# Altium schematic sheet coverSheet.SchDoc: FPGA Peripherals Board - Main
size A3; Author: mayerph; DrawnBy: mayerph; Organization: IIS; Revision: PA; SheetNumber: 1
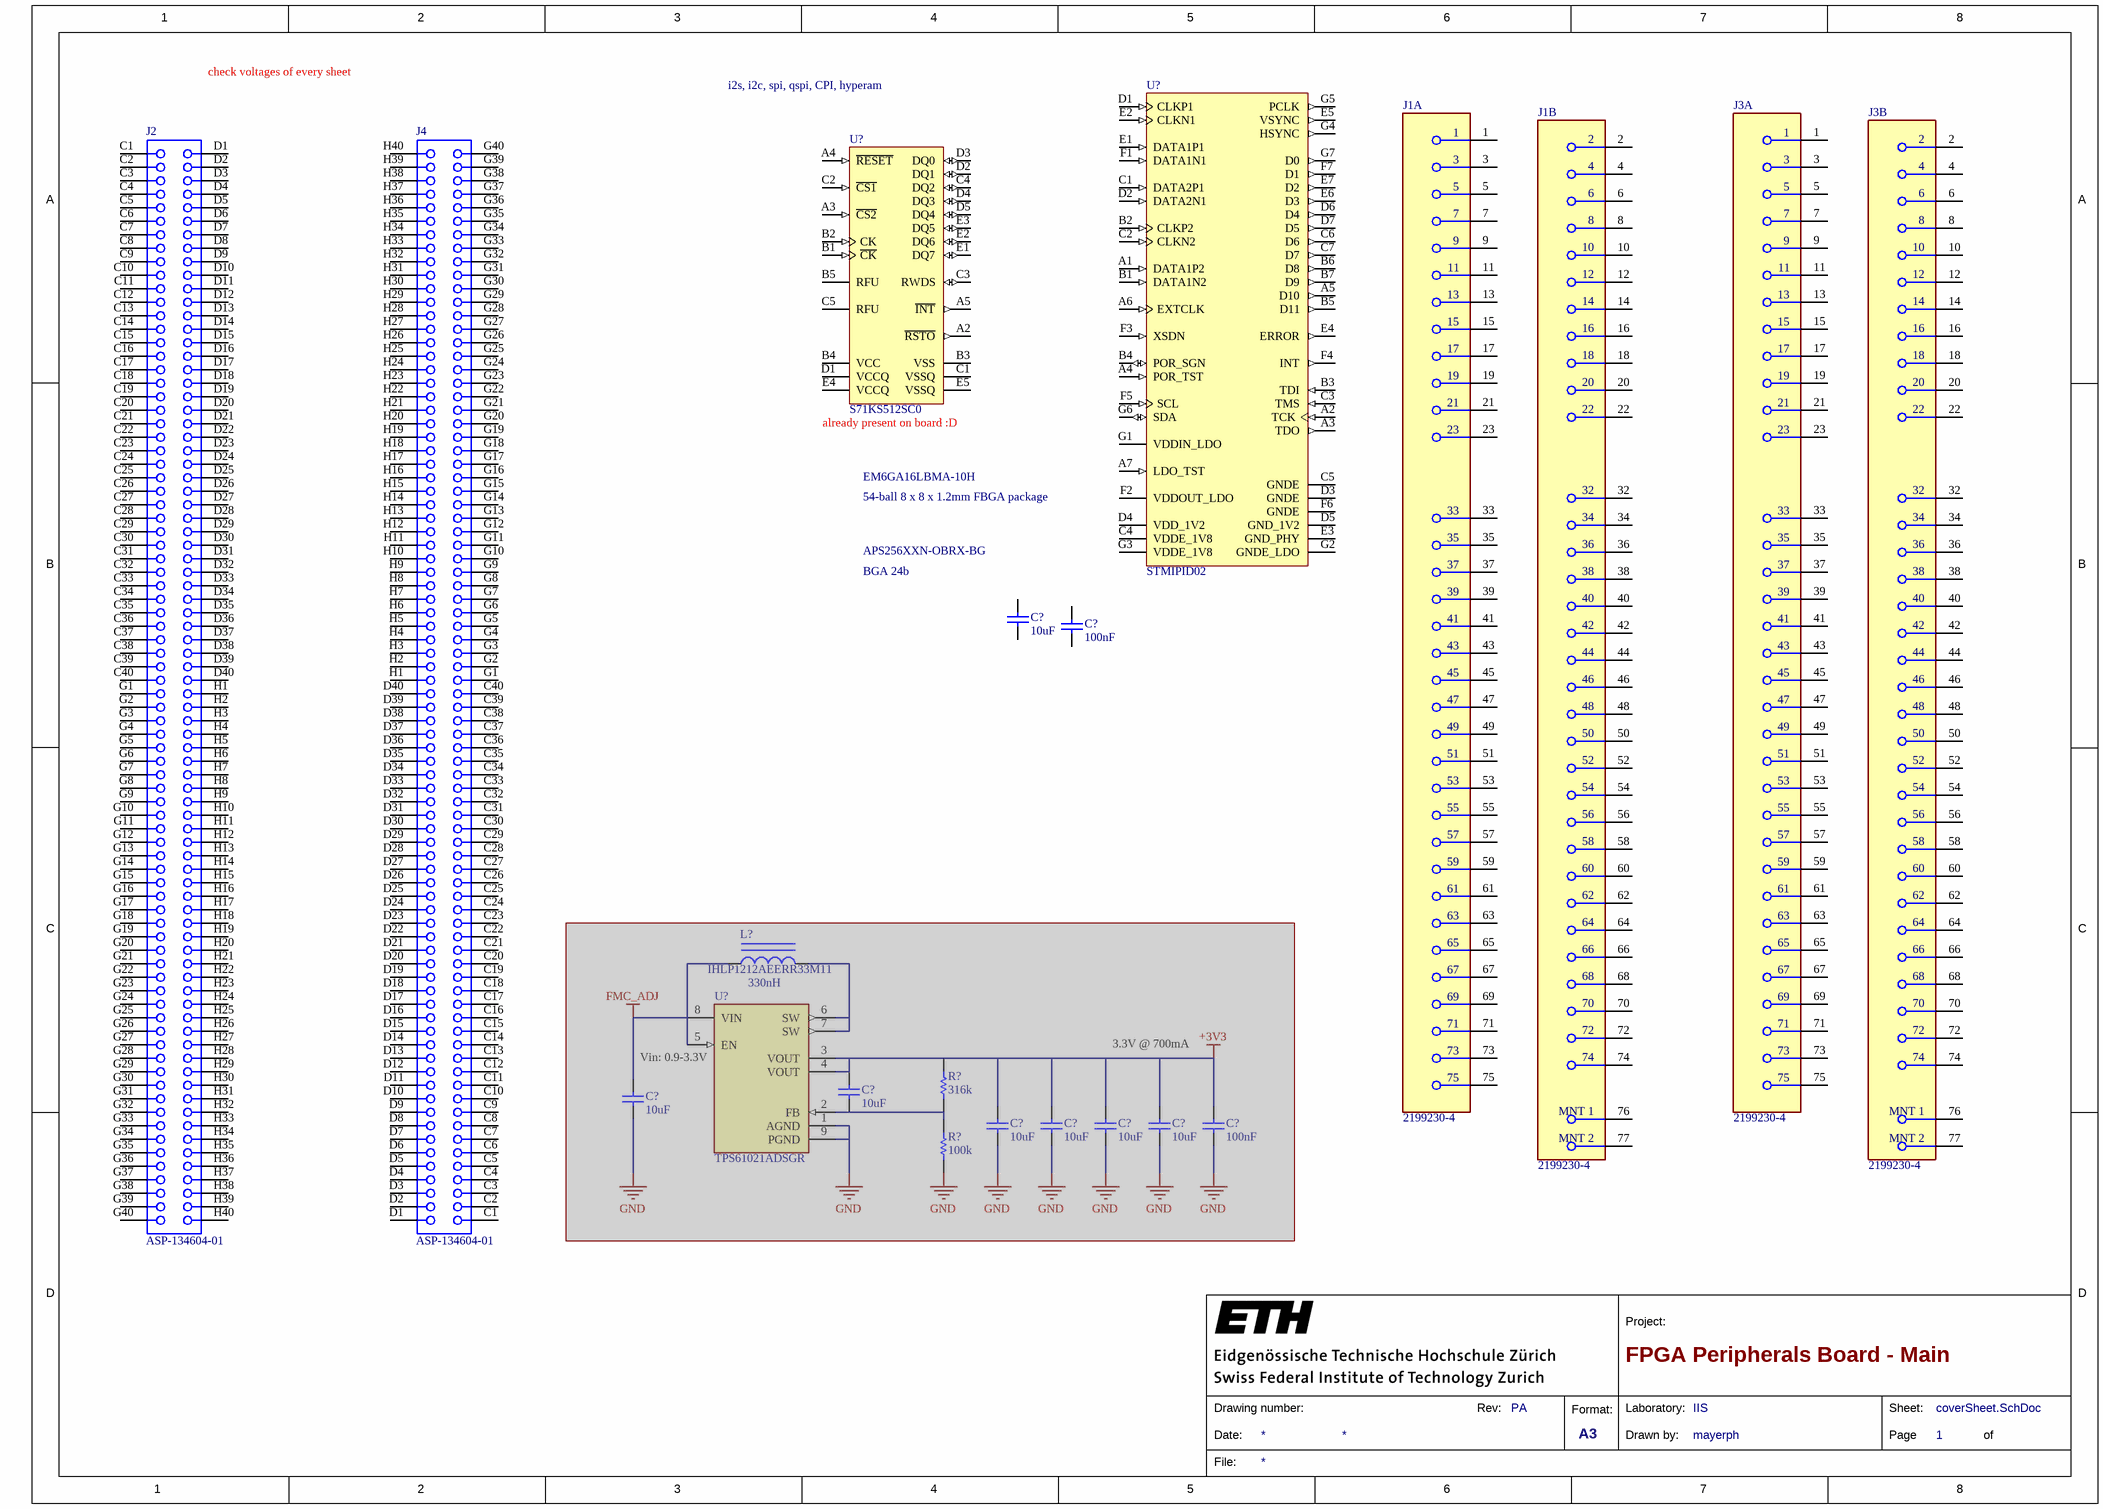
[diagram p0: coverSheet.SchDoc]

## Parts
(Parts that share a designator on the sheet are numbered #1, #2 ... from top to bottom, then left to right.)
C?#1  10uF  [CAPC0603(1608)100_L]
C?#2  100nF  [CAPC1050X55X23LL05T13]
C?#3  10uF  [CAPC0603(1608)100_L]  (masked out: inside a compile mask, not in the netlist)
C?#4  10uF  [CAPC0603(1608)100_L]  (masked out: inside a compile mask, not in the netlist)
C?#5  10uF  [CAPC0603(1608)100_L]  (masked out: inside a compile mask, not in the netlist)
C?#6  10uF  [CAPC0603(1608)100_L]  (masked out: inside a compile mask, not in the netlist)
C?#7  10uF  [CAPC0603(1608)100_L]  (masked out: inside a compile mask, not in the netlist)
C?#8  10uF  [CAPC0603(1608)100_L]  (masked out: inside a compile mask, not in the netlist)
C?#9  100nF  [CAPC1050X55X23LL05T13]  (masked out: inside a compile mask, not in the netlist)
J1  2199230-4  [FP-2199230-4-MFG]  (parts A,B of 2)
J2  ASP-134604-01  [ASP-134604-01]
J3  2199230-4  [FP-2199230-4-MFG]  (parts A,B of 2)
J4  ASP-134604-01  [ASP-134604-01]
L?  IHLP1212AEERR33M11  value 330nH  [IHLP1212]  (masked out: inside a compile mask, not in the netlist)
R?#1  316k  [RESC1005X40X25LL05T05]  (masked out: inside a compile mask, not in the netlist)
R?#2  100k  [RESC1005X40X25LL05T10]  (masked out: inside a compile mask, not in the netlist)
U?#1  STMIPID02  [BGA49C40P7X7_300X300X100]
U?#2  S71KS512SC0  [FBGA24_A-130]
U?#3  TPS61021ADSGR  [FP-DSG0008A-MFG]  (masked out: inside a compile mask, not in the netlist)

## Nets

Not connected (* = marked no-connect by the designer): C?#1 1 2; C?#2 1 2; J1 1 2 3 4 5 6 7 8 9 10 11 12 13 14 15 16 17 18 19 20 21 22 23 32 33 34 35 36 37 38 39 40 41 42 43 44 45 46 47 48 49 50 51 52 53 54 55 56 57 58 59 60 61 62 63 64 65 66 67 68 69 70 71 72 73 74 75 76(MNT_1) 77(MNT_2); J2 C1 C2 C3 C4 C5 C6 C7 C8 C9 C10 C11 C12 C13 C14 C15 C16 C17 C18 C19 C20 C21 C22 C23 C24 C25 C26 C27 C28 C29 C30 C31 C32 C33 C34 C35 C36 C37 C38 C39 C40 D1 D2 D3 D4 D5 D6 D7 D8 D9 D10 D11 D12 D13 D14 D15 D16 D17 D18 D19 D20 D21 D22 D23 D24 D25 D26 D27 D28 D29 D30 D31 D32 D33 D34 D35 D36 D37 D38 D39 D40 G1 G2 G3 G4 G5 G6 G7 G8 G9 G10 G11 G12 G13 G14 G15 G16 G17 G18 G19 G20 G21 G22 G23 G24 G25 G26 G27 G28 G29 G30 G31 G32 G33 G34 G35 G36 G37 G38 G39 G40 H1 H2 H3 H4 H5 H6 H7 H8 H9 H10 H11 H12 H13 H14 H15 H16 H17 H18 H19 H20 H21 H22 H23 H24 H25 H26 H27 H28 H29 H30 H31 H32 H33 H34 H35 H36 H37 H38 H39 H40; J3 1 2 3 4 5 6 7 8 9 10 11 12 13 14 15 16 17 18 19 20 21 22 23 32 33 34 35 36 37 38 39 40 41 42 43 44 45 46 47 48 49 50 51 52 53 54 55 56 57 58 59 60 61 62 63 64 65 66 67 68 69 70 71 72 73 74 75 76(MNT_1) 77(MNT_2); J4 C1 C2 C3 C4 C5 C6 C7 C8 C9 C10 C11 C12 C13 C14 C15 C16 C17 C18 C19 C20 C21 C22 C23 C24 C25 C26 C27 C28 C29 C30 C31 C32 C33 C34 C35 C36 C37 C38 C39 C40 D1 D2 D3 D4 D5 D6 D7 D8 D9 D10 D11 D12 D13 D14 D15 D16 D17 D18 D19 D20 D21 D22 D23 D24 D25 D26 D27 D28 D29 D30 D31 D32 D33 D34 D35 D36 D37 D38 D39 D40 G1 G2 G3 G4 G5 G6 G7 G8 G9 G10 G11 G12 G13 G14 G15 G16 G17 G18 G19 G20 G21 G22 G23 G24 G25 G26 G27 G28 G29 G30 G31 G32 G33 G34 G35 G36 G37 G38 G39 G40 H1 H2 H3 H4 H5 H6 H7 H8 H9 H10 H11 H12 H13 H14 H15 H16 H17 H18 H19 H20 H21 H22 H23 H24 H25 H26 H27 H28 H29 H30 H31 H32 H33 H34 H35 H36 H37 H38 H39 H40; U?#1 A1(DATA1P2) A2(TCK) A3(TDO) A4(POR_TST) A5(D10) A6(EXTCLK) A7(LDO_TST) B1(DATA1N2) B2(CLKP2) B3(TDI) B4(POR_SGN) B5(D11) B6(D8) B7(D9) C1(DATA2P1) C2(CLKN2) C3(TMS) C4(VDDE_1V8) C5(GNDE) C6(D6) C7(D7) D1(CLKP1) D2(DATA2N1) D3(GNDE) D4(VDD_1V2) D5(GND_1V2) D6(D4) D7(D5) E1(DATA1P1) E2(CLKN1) E3(GND_PHY) E4(ERROR) E5(VSYNC) E6(D3) E7(D2) F1(DATA1N1) F2(VDDOUT_LDO) F3(XSDN) F4(INT) F5(SCL) F6(GNDE) F7(D1) G1(VDDIN_LDO) G2(GNDE_LDO) G3(VDDE_1V8) G4(HSYNC) G5(PCLK) G6(SDA) G7(D0); U?#2 A2(~{RSTO}) A3(~{CS2}) A4(~{RESET}) A5(~{INT}) B1(~{CK}) B2(CK) B3(VSS) B4(VCC) B5(RFU) C1(VSSQ) C2(~{CS1}) C3(RWDS) C4(DQ2) C5(RFU) D1(VCCQ) D2(DQ1) D3(DQ0) D4(DQ3) D5(DQ4) E1(DQ7) E2(DQ6) E3(DQ5) E4(VCCQ) E5(VSSQ)

## Notes on the sheet
- check voltages of every sheet
- i2s, i2c, spi, qspi, CPI, hyperam
- (near U?#2) already present on board :D
- EM6GA16LBMA-10H
- 54-ball 8 x 8 x 1.2mm FBGA package
- APS256XXN-OBRX-BG
- BGA 24b
- 3.3V @ 700mA
- (near U?#3) Vin: 0.9-3.3V
- 1
- 2
- 3
- 4
- 5
- 6
- 7
- 8
- A
- B
- C
- D
- Project:
- Date:
- Drawing number:
- Rev:
- Format:
- A3
- Drawn by:
- Laboratory:
- Page
- Sheet:
- of
- File:

## Library data of the parts
C?#1 C?#3-C?#8 = CMP-1035-02799-1: CAP 10uF 10V ±10% 0603 (1608 Metric) Thickness 1mm SMD; Manufacturer: Samsung; Manufacturer Part Number: CL10A106MP8NNNC; Tolerance: Â±10%; Case-Metric: 1608; Case-EIA: 0603; Dielectric: X5R; Max Thickness: 1 mm; Technology: SMT; Rated Voltage: 10 V; Value: 10uF; Supplier 1: Digi-Key; Supplier Part Number 1: 1276-1871-1-ND; RoHS: Yes; Category: Ceramic Capacitors; Stock 1: 643992; Pricing 1: 1=0.26000, 10=0.17600, 50=0.10580, 100=0.08930, 500=0.06112, 1000=0.05407 (USD); Mount: Surface Mount; Case/Package: 0603; Case Code (Imperial): 0603; Case Code (Metric): 1608; Contact Plating: Tin; Min Operating Temperature: -55°C; Max Operating Temperature: 85°C; Packaging: Tape and Reel; Capacitance: 10uF; Voltage Rating: 10V; Voltage Rating (DC): 10V; Package Quantity: 1; Length: 1.6mm; Width: 0.031inch; Height: 0.8mm; Thickness: 0.035inch; Depth: 0.8mm; Radiation Hardening: No; Lead Free: Lead Free; ComponentLink1URL: https://datasheet.ciiva.com/25793/cl10a106mp8nnnc-25793222.pdf?src-supplier=Digi-Key; ComponentLink1Description: https://datasheet.ciiva.com/25793/cl10a106mp8nnnc-25793222.pdf?src-supplier=Digi-Key; ComponentLink2URL: https://datasheet.ciiva.com/16200/cl10a106mp8nnnc-16200411.pdf?src-supplier=Future+Electronics; ComponentLink2Description: https://datasheet.ciiva.com/16200/cl10a106mp8nnnc-16200411.pdf?src-supplier=Future+Electronics; ComponentLink3URL: https://datasheet.ciiva.com/26946/getdatasheetpartid-357531-26946980.pdf?src-supplier=Verical; ComponentLink3Description: https://datasheet.ciiva.com/26946/getdatasheetpartid-357531-26946980.pdf?src-supplier=Verical
C?#2 C?#9 = CMP-2000-05439-1: Chip Capacitor, 100 nF, +/- 10%, 16 V, -55 to 125 degC, 0402 (1005 Metric), RoHS, Tape and Reel; Manufacturer: Samsung Electro-Mechanics; Manufacturer Part Number: CL05B104KO5NNNC; Dielectric: X7R; Rated Voltage: 16V; Material: Ceramic; Case Size/Dimension: 0402; Tolerance (%): ±10%; Value: 100nF; Manufacturer URL: http://www.samsungsem.com/global/index.jsp; Datasheet URL: https://datasheet.ciiva.com/29198/458718-da-01-en-vs-kondensator-0402-29198423.pdf; Datasheet Version: Nov-10; Supplier 1: Digi-Key; Supplier Part Number 1: 1276-1001-1-ND; RoHS: Yes; Category: Ceramic Capacitors; Stock 1: 18886859; Pricing 1: 1=0.10000, 10=0.02800, 50=0.01520, 100=0.01240, 500=0.00886, 1000=0.00696, 2500=0.00632, 5000=0.00582 (USD); Mount: Surface Mount; Case/Package: 0402; Case Code (Metric): 1005; Case Code (Imperial): 0402; Contact Plating: Tin; Min Operating Temperature: -55°C; Max Operating Temperature: 125°C; Tolerance: 10%; Packaging: Tape and Reel; Voltage Rating: 16V; Voltage Rating (DC): 16V; Package Quantity: 1; Voltage: 16V; Length: 1mm; Height: 0.5mm; Width: 0.02inch; Depth: 0.5mm; Thickness: 0.022inch; Radiation Hardening: No; Lead Free: Lead Free; ComponentLink1URL: https://datasheet.ciiva.com/26920/getdatasheetpartid-359683-26920169.pdf?src-supplier=Verical; ComponentLink1Description: https://datasheet.ciiva.com/26920/getdatasheetpartid-359683-26920169.pdf?src-supplier=Verical; ComponentLink2URL: https://datasheet.ciiva.com/29198/458718-da-01-en-vs-kondensator-0402-29198423.pdf?src-supplier=Conrad; ComponentLink2Description: https://datasheet.ciiva.com/29198/458718-da-01-en-vs-kondensator-0402-29198423.pdf?src-supplier=Conrad; ComponentLink3URL: https://datasheet.ciiva.com/16208/cl05b104kq5nnnc-16208343.pdf?src-supplier=Future+Electronics; ComponentLink3Description: https://datasheet.ciiva.com/16208/cl05b104kq5nnnc-16208343.pdf?src-supplier=Future+Electronics; ComponentLink4URL: https://datasheet.ciiva.com/26309/mlcc-catalogdownload2013-eng-26309003.pdf?src-supplier=Distrelec; ComponentLink4Description: https://datasheet.ciiva.com/26309/mlcc-catalogdownload2013-eng-26309003.pdf?src-supplier=Distrelec
J1 J3 = CMP-03365-000002-1: CONN FEMALE 67POS 0.020 GOLD; Manufacturer: TE Connectivity; Conn Orientation: Right Angle; Pitch: 0.5mm; Number Of Contacts: 67; Voltage Rating: 50V; Is Female: yes; Current Rating: 0.5A; Contact Current Rating: 500mA; Insulation Resistance: 500MR; Row Spacing: 7.55mm; Lead Free: Yes; Temperature Range Low: -40°C; Device Class L3: unset; Package: 0; Manufacturer Part Number: 2199230-4; RoHS: TRUE; Digikey Description: CONN FEMALE 67POS 0.020 GOLD; Category: Conn; Device Class L1: Connectors; Temperature Range High: +80°C; ComponentLink2Description: Datasheet; ComponentLink2URL: https://www.te.com/commerce/DocumentDelivery/DDEController?Action=showdoc&DocId=Customer+Drawing%7F2199230%7FB3%7Fpdf%7FEnglish%7FENG_CD_2199230_B3.pdf%7F2199230-4; Mouser Description: PCI Express / PCI Connectors .5PITCH 4.2H KEY E EMBOSS NGFF MINICARD; Automotive: No; Conn Gender: Female; Height: 4.2mm; Device Class L2: Card Edge Connectors; Contact Material: Gold,Nickel; Number Of Rows: 2; Octopart: https://octopart.com/2199230-4-te+connectivity-46436156; Temperature: -40°C to +80°C; Supplier 1: Digi-Key; Supplier Part Number 1: A115904CT-ND; Stock 1: 15639; Pricing 1: 1=1.29000, 10=1.13700, 25=1.07000, 50=1.02560, 100=0.98100, 250=0.89180, 500=0.80262 (USD); Mount: Surface Mount; Contact Plating: Gold,Matte; Housing Color: Black; Housing Material: Thermoplastic; Color: Black; Insulation Material: Thermoplastic; Min Operating Temperature: -40°C; Max Operating Temperature: 80°C; Packaging: Tape and Reel; Number of Positions: 67; PCB Mounting Orientation: Right Angle; Package Quantity: 1; Gender: Female; Termination: Solder; Orientation: Right Angle; Length: 0.862inch; Width: 8.7mm; REACH SVHC: Unknown; ELV: Compliant; ComponentLink1URL: https://datasheet.ciiva.com/28797/1918022-28797830.pdf?src-supplier=Element14; ComponentLink1Description: https://datasheet.ciiva.com/28797/1918022-28797830.pdf?src-supplier=Element14; ComponentLink3URL: https://datasheet.ciiva.com/18495/eng-cd-2199230-b1-c-2199230-b1-18495978.pdf?src-supplier=Digi-Key; ComponentLink3Description: https://datasheet.ciiva.com/18495/eng-cd-2199230-b1-c-2199230-b1-18495978.pdf?src-supplier=Digi-Key; ComponentLink4URL: https://datasheet.ciiva.com/18495/eng-cd-2199230-b1-c-2199230-b1-18495979.pdf?src-supplier=Digi-Key; ComponentLink4Description: https://datasheet.ciiva.com/18495/eng-cd-2199230-b1-c-2199230-b1-18495979.pdf?src-supplier=Digi-Key; ComponentLink5URL: https://datasheet.ciiva.com/18495/eng-cd-2199230-b1-c-2199230-b1-18495980.pdf?src-supplier=Digi-Key; ComponentLink5Description: https://datasheet.ciiva.com/18495/eng-cd-2199230-b1-c-2199230-b1-18495980.pdf?src-supplier=Digi-Key; ComponentLink6URL: https://datasheet.ciiva.com/22714/1918022-22714780.pdf?src-supplier=Element14; ComponentLink6Description: https://datasheet.ciiva.com/22714/1918022-22714780.pdf?src-supplier=Element14; ComponentLink7URL: https://datasheet.ciiva.com/28797/1918022-28797822.pdf?src-supplier=Element14; ComponentLink7Description: https://datasheet.ciiva.com/28797/1918022-28797822.pdf?src-supplier=Element14
J2 = CMP-00488-1: Conn Array Terminal FMC Male SKT 160 POS 1.27mm Solder ST SMD; Manufacturer: Samtec; Number of arrays: 4; Number of poles: 160; Pitch: 1.27mm; Product type: SKT; Width: 14.68mm; Wire connection method: Solder; Length: 55.78mm; Manufacturer Part Number: ASP-134604-01; Supplier: Digikey; Supplier Part Number: SAM8732-ND; ComponentLink1Description: asp-134604-01-9532665.pdf; ComponentLink1URL: https://datasheet.ciiva.com/9532/asp-134604-01-9532665.pdf; ComponentLink2Description: asp-134604-01-403751.pdf; ComponentLink2URL: https://datasheet.ciiva.com/403/asp-134604-01-403751.pdf
J4 = CMP-00488-2: Conn Array Terminal FMC Male SKT 160 POS 1.27mm Solder ST SMD; Manufacturer: Samtec; Number of arrays: 4; Number of poles: 160; Pitch: 1.27mm; Product type: SKT; Width: 14.68mm; Wire connection method: Solder; Length: 55.78mm; Manufacturer Part Number: ASP-134604-01; Supplier: Digikey; Supplier Part Number: SAM8732-ND; ComponentLink1Description: asp-134604-01-9532665.pdf; ComponentLink1URL: https://datasheet.ciiva.com/9532/asp-134604-01-9532665.pdf; ComponentLink2Description: asp-134604-01-403751.pdf; ComponentLink2URL: https://datasheet.ciiva.com/403/asp-134604-01-403751.pdf
L? = CMP-01325-1: FIXED IND 330NH 7.8A 13.8 MOHM; Max DC Current: 7A; DC Resistance (DCR): 13.8mR; Tolerance: 20%; Test Frequency: 100kHz; Core Material: Ferrite; Shielding: Shielded; Self Resonant Frequency: 1MHz; Number of Pins: 2; Rated Current-Max: 7.8A; Packaging: Tape and Reel; Radiation Hardening: No; Depth: 3.2mm; Termination: SMD/SMT; REACH SVHC: Unknown; Width: 3mm; Height - Seated (Max): 0.059inch; Current Rating: 7.8A; Min Operating Temperature: -55°C; Case/Package: 1212; Package Quantity: 3000; Inductance: 330nH; Series: IHLP-1212AE-11; Lead Free: Lead Free; Height: 1.2mm; RMS Current (Irms): 7.8A; Saturation Current: 7A; Inductance Tolerance: 20%; Military Standard: Not; Max Operating Temperature: 125°C; Length: 3.6mm; Mount: Surface Mount; RoHS Compliant: Yes
R?#1 = CMP-2002-00863-1: Manufacturer: Panasonic; Part Number: ERJ-2RKF3163X; Value: 316 kOhm; Power Rating: 100mW; Tolerance: 1%; Temperature Coefficient: 100ppm/°C; Voltage Rating: 50V; Supplier 1: Digi-Key; Supplier Part Number 1: P316KLCT-ND; Manufacturer Part Number: ERJ-2RKF3163X; RoHS: Yes; Category: Chip SMD Resistors; Stock 1: 50; Pricing 1: 1=0.10000, 10=0.02200, 100=0.00880, 1000=0.00398, 2500=0.00345, 5000=0.00285 (USD); Mount: Surface Mount; Case/Package: 0402; Case Code (Metric): 1005; Case Code (Imperial): 0402; Contact Plating: Tin; Min Operating Temperature: -55°C; Max Operating Temperature: 155°C; Packaging: Tape and Reel; Resistor Type: Thick Film; Package Quantity: 1; Termination: SMD/SMT; Series: ERJ; Voltage Rating (DC): 50V; Number of Terminations: 2; Max Power Dissipation: 100mW; Features: Automotive AEC-Q200; Construction: Rectangular; Resistance Tolerance: 1%; Length: 1mm; Width: 0.02inch; Height: 0.016inch; Depth: 0.5mm; RoHS Compliant: Yes; Lead Free: Lead Free; REACH SVHC: No SVHC; Military Standard: Not; ComponentLink1URL: https://datasheet.ciiva.com/24070/aoa0000ce2-24070773.pdf?src-supplier=Mouser; ComponentLink1Description: https://datasheet.ciiva.com/24070/aoa0000ce2-24070773.pdf?src-supplier=Mouser; ComponentLink2URL: https://datasheet.ciiva.com/43467/1678782-43467525.pdf?src-supplier=Farnell; ComponentLink2Description: https://datasheet.ciiva.com/43467/1678782-43467525.pdf?src-supplier=Farnell; ComponentLink3URL: https://datasheet.ciiva.com/30180/aoa0000ce2-30180486.pdf?src-supplier=Onlinecomponents.com; ComponentLink3Description: https://datasheet.ciiva.com/30180/aoa0000ce2-30180486.pdf?src-supplier=Onlinecomponents.com; ComponentLink4URL: https://datasheet.ciiva.com/9183/aoa0000ce2-9183095.pdf?src-supplier=Avnet; ComponentLink4Description: https://datasheet.ciiva.com/9183/aoa0000ce2-9183095.pdf?src-supplier=Avnet; ComponentLink5URL: https://datasheet.ciiva.com/16514/aoa0000ce2-16514328.pdf?src-supplier=Avnet+Asia; ComponentLink5Description: https://datasheet.ciiva.com/16514/aoa0000ce2-16514328.pdf?src-supplier=Avnet+Asia; ComponentLink6URL: https://datasheet.ciiva.com/16762/70260748-16762152.pdf?src-supplier=Allied+Electronics; ComponentLink6Description: https://datasheet.ciiva.com/16762/70260748-16762152.pdf?src-supplier=Allied+Electronics; ComponentLink7URL: https://datasheet.ciiva.com/46373/1678782-46373322.pdf?src-supplier=Element14; ComponentLink7Description: https://datasheet.ciiva.com/46373/1678782-46373322.pdf?src-supplier=Element14; ComponentLink8URL: https://datasheet.ciiva.com/46373/1678782-46373323.pdf?src-supplier=Element14; ComponentLink8Description: https://datasheet.ciiva.com/46373/1678782-46373323.pdf?src-supplier=Element14; ComponentLink9URL: https://datasheet.ciiva.com/22663/1678782-22663805.pdf?src-supplier=Farnell; ComponentLink9Description: https://datasheet.ciiva.com/22663/1678782-22663805.pdf?src-supplier=Farnell; ComponentLink10URL: https://datasheet.ciiva.com/7853/aoa0000ce2-7853694.pdf?src-supplier=Element14; ComponentLink10Description: https://datasheet.ciiva.com/7853/aoa0000ce2-7853694.pdf?src-supplier=Element14; ComponentLink11URL: https://datasheet.ciiva.com/16761/70260748-16761806.pdf?src-supplier=Allied+Electronics; ComponentLink11Description: https://datasheet.ciiva.com/16761/70260748-16761806.pdf?src-supplier=Allied+Electronics; ComponentLink12URL: https://datasheet.ciiva.com/28564/1694929-28564143.pdf?src-supplier=Element14; ComponentLink12Description: https://datasheet.ciiva.com/28564/1694929-28564143.pdf?src-supplier=Element14
R?#2 = CMP-2002-07343-1: Part Number: RC0402FR-07100KL; Manufacturer: Yageo / Phycomp; Value: 100 kOhm; Power Rating: 63mW; Tolerance: 1%; Temperature Coefficient: 100ppm/°C; Voltage Rating: 50V; Supplier 1: Digi-Key; Supplier Part Number 1: 311-100KLRCT-ND; Manufacturer Part Number: RC0402FR-07100KL; RoHS: Yes; Category: Chip SMD Resistors; Stock 1: 23516570; Pricing 1: 1=0.10000, 10=0.01400, 100=0.00580, 1000=0.00260, 2500=0.00226, 5000=0.00186 (USD); Case/Package: 0402; Case Code (Metric): 1005; Case Code (Imperial): 0402; Min Operating Temperature: -55°C; Max Operating Temperature: 155°C; Packaging: Tape and Reel; Series: RC; Max Power Dissipation: 63mW; Termination: SMD/SMT; Resistor Type: Thick Film; Package Quantity: 1; Number of Terminations: 2; Construction: Rectangular; Resistance Tolerance: 1%; Features: Moisture Resistant; Technology: THICK FILM; Working Voltage: 50V; Length: 0.039inch; Width: 0.02inch; Height: 0.016inch; Depth: 0.5mm; RoHS Compliant: Yes; Military Standard: Not; Lead Free: Lead Free; REACH SVHC: No SVHC; ComponentLink1URL: https://datasheet.ciiva.com/11819/0900766b80c66297-11819452.pdf?src-supplier=RSComponents; ComponentLink1Description: https://datasheet.ciiva.com/11819/0900766b80c66297-11819452.pdf?src-supplier=RSComponents; ComponentLink2URL: https://datasheet.ciiva.com/2453/pyu-r-int-thick-7-2453361.pdf?src-supplier=Digi-Key; ComponentLink2Description: https://datasheet.ciiva.com/2453/pyu-r-int-thick-7-2453361.pdf?src-supplier=Digi-Key; ComponentLink3URL: https://datasheet.ciiva.com/2453/pyu-r-int-thick-7-2453362.pdf?src-supplier=Digi-Key; ComponentLink3Description: https://datasheet.ciiva.com/2453/pyu-r-int-thick-7-2453362.pdf?src-supplier=Digi-Key; ComponentLink4URL: https://datasheet.ciiva.com/2453/pyu-r-int-thick-7-2453363.pdf?src-supplier=Digi-Key; ComponentLink4Description: https://datasheet.ciiva.com/2453/pyu-r-int-thick-7-2453363.pdf?src-supplier=Digi-Key; ComponentLink5URL: https://datasheet.ciiva.com/22747/1018594-22747509.pdf?src-supplier=Element14; ComponentLink5Description: https://datasheet.ciiva.com/22747/1018594-22747509.pdf?src-supplier=Element14; ComponentLink6URL: https://datasheet.ciiva.com/15189/getdatasheetpartid-323696-15189334.pdf?src-supplier=Verical; ComponentLink6Description: https://datasheet.ciiva.com/15189/getdatasheetpartid-323696-15189334.pdf?src-supplier=Verical; ComponentLink7URL: https://datasheet.ciiva.com/12667/pyu-rc0402-51-rohs-l-6-r-12667930.pdf?src-supplier=Mouser; ComponentLink7Description: https://datasheet.ciiva.com/12667/pyu-rc0402-51-rohs-l-6-r-12667930.pdf?src-supplier=Mouser
U?#1 = CMP-01317-1: Dual deserializer for MIPI/CSI-2 and SMIA/ CCP2 buses; Screening Level: Commercial; Max Processing Temp: 260; Operating Temperature: -25 to 70 °C; Mounting: Surface Mount; Supplier Package: VFBGA; Type: Dual Mode MIPI CSI-2/SMIA CCP2 Deserializer; Pin Count: 49; Category: Dual Mode MIPI CSI-2/SMIA CCP2 Deserializer; Product Dimensions: 3 x 3 x 0.615
U?#2 = CMP-00514-3: IC 512MB FLASH 64MB DRAM 24FBGA; Manufacturer: Cypress Semiconductor Corp; Speed: 100MHz; Voltage - Supply: 1.8V; Memory Format: FLASH, RAM; Interface: Parallel, Serial; Memory Type: Non-Volatile; Memory Size: 512Mbit Flash, 64Mbit RAM; Package / Case: 24-VBGA; Series: HyperFlash™ + HyperRAM™ KS; Supplier Device Package: 24-FBGA(6x8)
U?#3 = CMP-04918-000096-1: IC REG BOOST ADJUSTABLE 3A 8WSON; Manufacturer: Texas Instruments; Output Voltage: 1.8-4V; Standoff Height: 0mm; Switching Frequency: 2MHz; Number Of Outputs: 1; Max Duty Cycle: 90%; Max Supply Voltage: 4.4V; Output Type: AdjustableProgrammable; Output Current: 1.5A; Nominal Supply Current: 17uA; Min Supply Voltage: 0.5V; Max Junction Temp: +125°C; Category: IC; RoHS: TRUE; Device Class L2: Power Management ICs; Temperature: -40°C to +125°C; Automotive: No; Height: 0.8mm; Device Class L3: Voltage Regulators - Switching; Lead Free: Yes; Ipc Land Pattern Name: DFN200X200X80-8; ComponentLink2URL: http://www.ti.com/lit/ds/symlink/tps61021a.pdf; Package: DSG0008A; Switching Topology: Boost; Manufacturer Part Number: TPS61021ADSGR; ComponentLink2Description: Datasheet; Device Class L1: Integrated Circuits (ICs); Mouser Description: 3-A Boost Converter with 0.5-V Ultra Low Input Voltage 8-WSON -40 to 125; Octopart: https://octopart.com/tps61021adsgr-texas+instruments-74531141; Digikey Description: IC REG BOOST ADJUSTABLE 3A 8WSON; Temperature Range Low: -40°C; Temperature Range High: +125°C